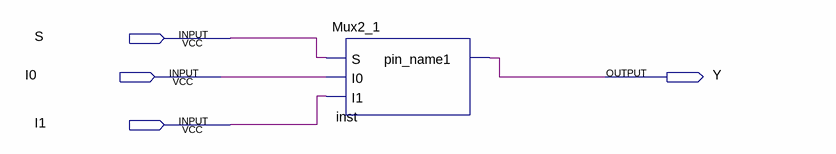
[diagram p0: schematic sheet]
// Quartus schematic MuxDemo.bdf as structural Verilog: 1 symbols, 4 pins
module MuxDemo (
  input  S,
  input  I0,
  input  I1,
  output Y
);

  Mux2_1 inst (.S(S), .I0(I0), .I1(I1), .pin_name1(Y));
endmodule
